# Altium schematic sheet Actuators.SchDoc: Actuators
size A3; SheetNumber: 6
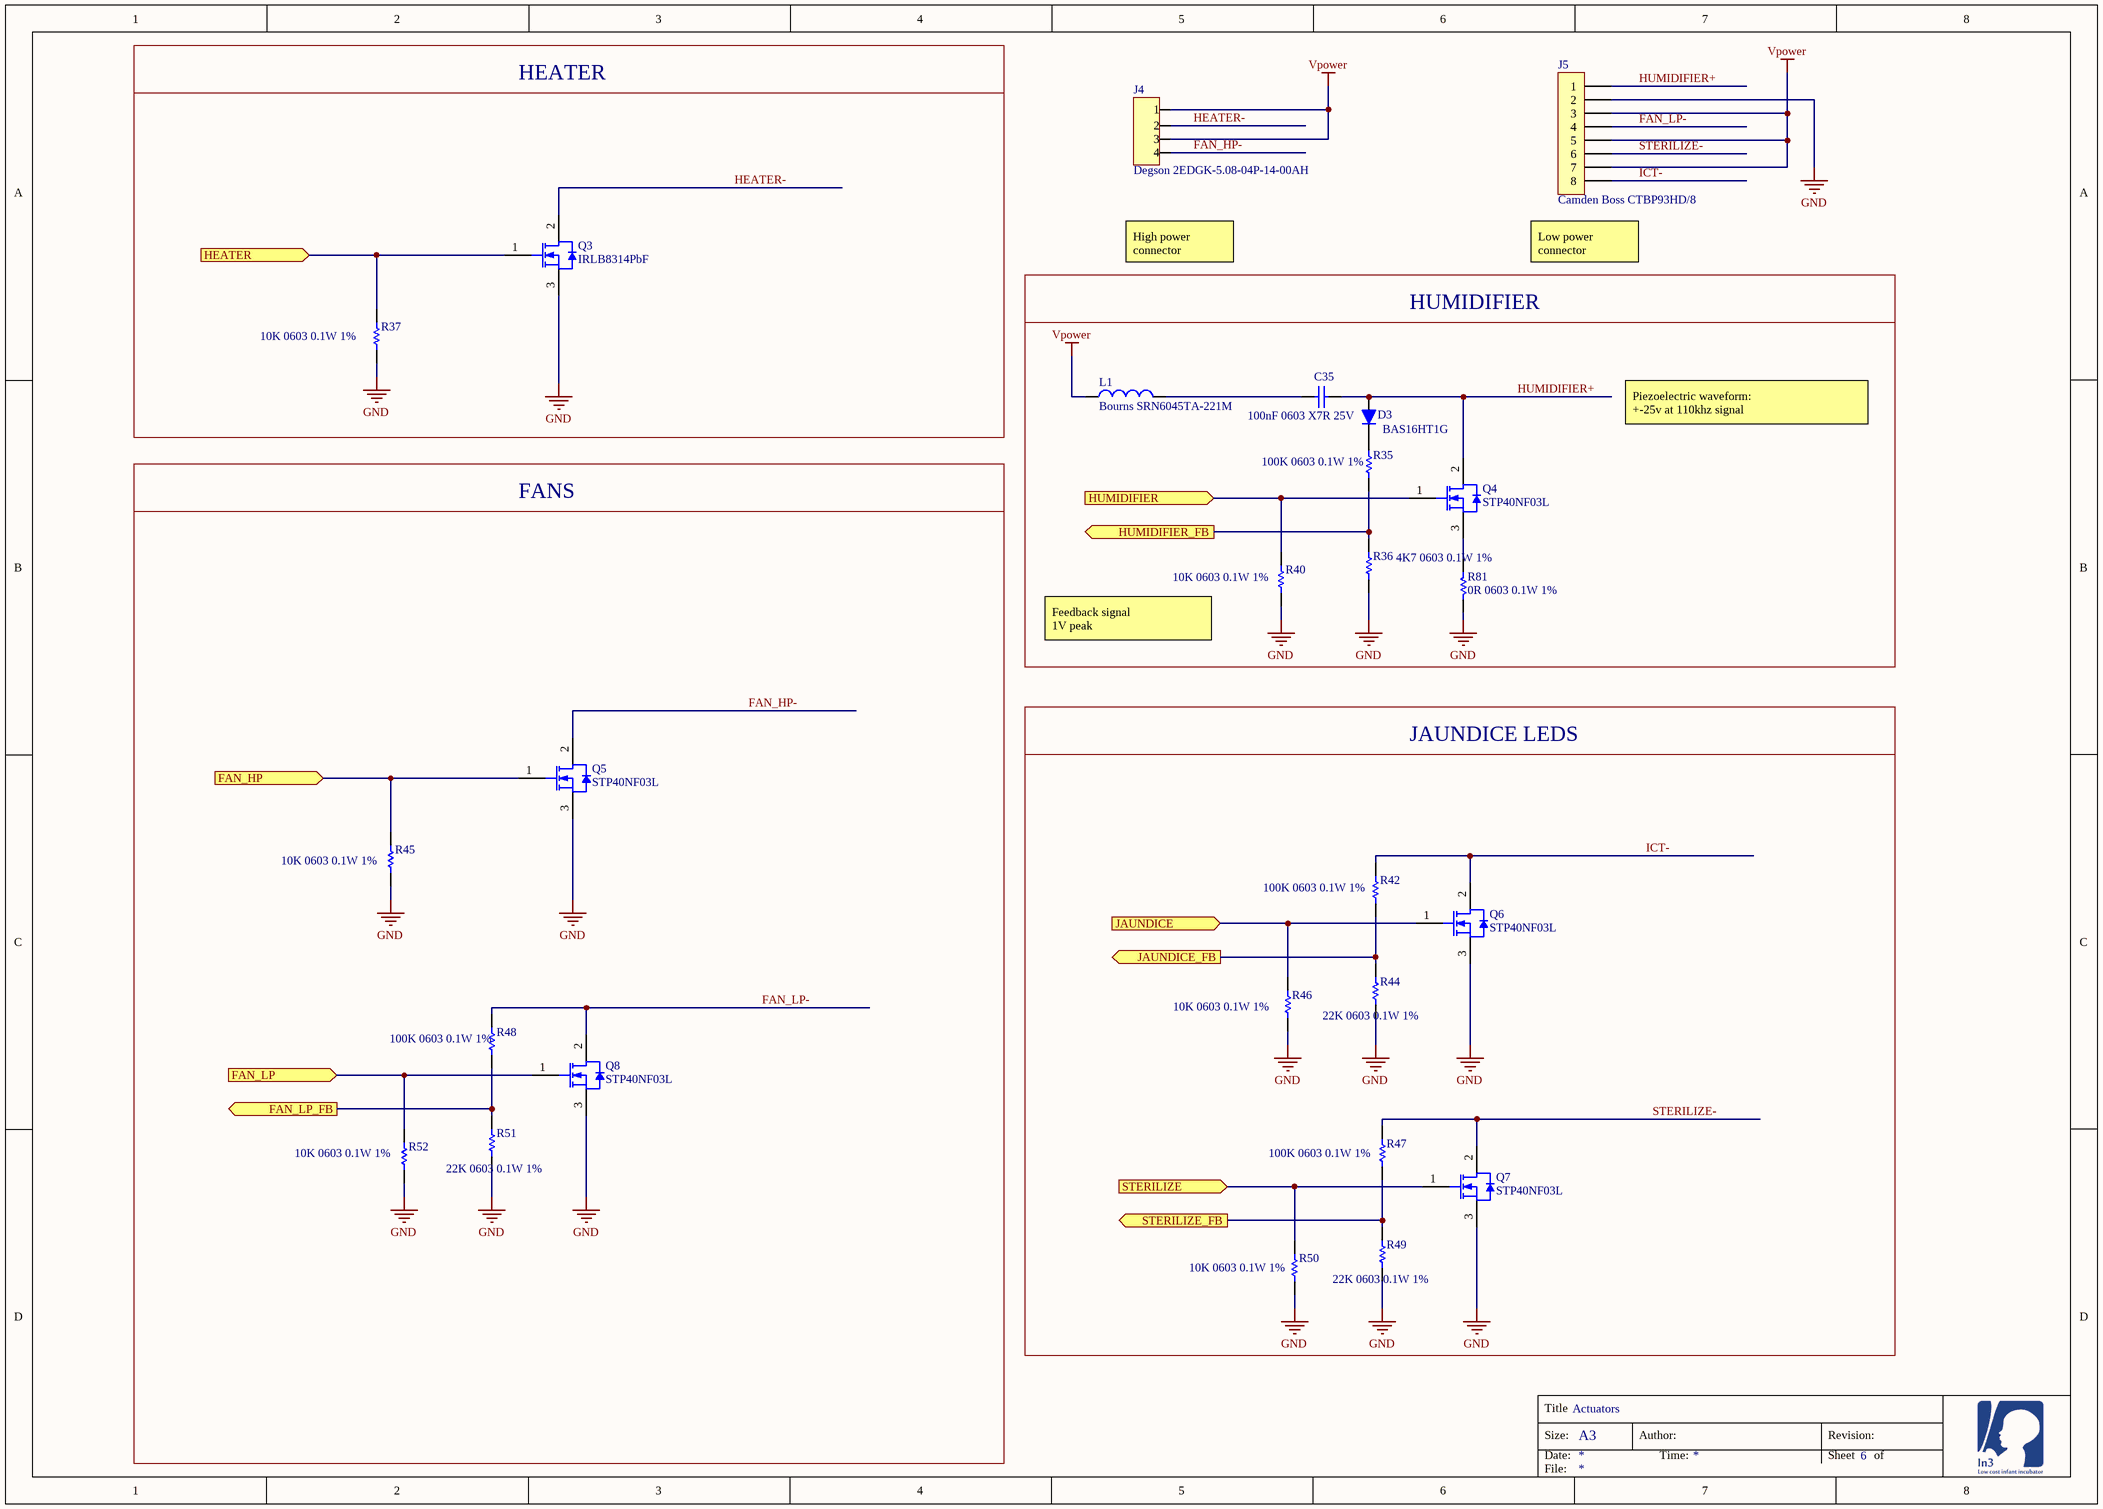
[diagram p0: Actuators.SchDoc]

## Parts
C35  100nF 0603 X7R 25V  [CAPC1608X60X35NL10T15]
D3  Manufacturer Part Number: BAS16HT1G  [PCB-eawsmpajajexc0e6wrcv-1]  (hidden comment: ON Semiconductor BAS16HT1G)
J4  Degson 2EDGK-5.08-04P-14-00AH  [PCB-h4cyb3wxd4gf7j132tzl-1]
J5  Camden Boss CTBP93HD/8  [PCB-x5bf0tdd06kg49qqqpah-1]
L1  Bourns SRN6045TA-221M  [PCB-wv16t2tzy3vtnr72ahin-1]
Q3  IRLB8314PbF  [ONSC-TO-220-3-221A-07]
Q4  STP40NF03L  [ONSC-TO-220-3-221A-07]
Q5  STP40NF03L  [ONSC-TO-220-3-221A-07]
Q6  STP40NF03L  [ONSC-TO-220-3-221A-07]
Q7  STP40NF03L  [ONSC-TO-220-3-221A-07]
Q8  STP40NF03L  [ONSC-TO-220-3-221A-07]
R35  100K 0603 0.1W 1%  [RESC1609X55X30ML10T20]
R36  4K7 0603 0.1W 1%  [RESC1609X55X30ML10T20]
R37  10K 0603 0.1W 1%  [RESC1609X55X30ML10T20]
R40  10K 0603 0.1W 1%  [RESC1609X55X30ML10T20]
R42  100K 0603 0.1W 1%  [RESC1609X55X30ML10T20]
R44  22K 0603 0.1W 1%  [RESC1609X55X30ML10T20]
R45  10K 0603 0.1W 1%  [RESC1609X55X30ML10T20]
R46  10K 0603 0.1W 1%  [RESC1609X55X30ML10T20]
R47  100K 0603 0.1W 1%  [RESC1609X55X30ML10T20]
R48  100K 0603 0.1W 1%  [RESC1609X55X30ML10T20]
R49  22K 0603 0.1W 1%  [RESC1609X55X30ML10T20]
R50  10K 0603 0.1W 1%  [RESC1609X55X30ML10T20]
R51  22K 0603 0.1W 1%  [RESC1609X55X30ML10T20]
R52  10K 0603 0.1W 1%  [RESC1609X55X30ML10T20]
R81  0R 0603 0.1W 1%  [RESC1609X55X30ML10T20]

## Blocks framed on the sheet
HEATER: Q3 R37
HUMIDIFIER: C35 D3 L1 Q4 R35 R36 R40 R81
FANS: Q5 Q8 R45 R48 R51 R52
JAUNDICE LEDS: Q6 Q7 R42 R44 R46 R47 R49 R50

## Ports
FAN_HP (in), FAN_LP (in), FAN_LP_FB (out), HEATER (in), HUMIDIFIER (in), HUMIDIFIER_FB (out), JAUNDICE (in), JAUNDICE_FB (out), STERILIZE (in), STERILIZE_FB (out)

## Nets
GND: J5.2 Q3.3(SOURCE) Q5.3(SOURCE) Q6.3(SOURCE) Q7.3(SOURCE) Q8.3(SOURCE) R36.1 R37.1 R40.1 R44.2 R45.1 R46.1 R49.2 R50.1 R51.1 R52.1 R81.2
Vpower: J4.1 J4.3 J5.3 J5.5 J5.7 L1.1
FAN_HP: Q5.1(GATE) R45.2 ; port FAN_HP
FAN_HP-: J4.4 Q5.2(DRAIN)
FAN_LP: Q8.1(GATE) R52.2 ; port FAN_LP
FAN_LP-: J5.4 Q8.2(DRAIN) R48.1
FAN_LP_FB: R48.2 R51.2 ; port FAN_LP_FB
HEATER: Q3.1(GATE) R37.2 ; port HEATER
HEATER-: J4.2 Q3.2(DRAIN)
HUMIDIFIER: Q4.1(GATE) R40.2 ; port HUMIDIFIER
HUMIDIFIER+: C35.1 D3.2(A) J5.1 Q4.2(DRAIN)
HUMIDIFIER_FB: R35.2 R36.2 ; port HUMIDIFIER_FB
ICT-: J5.8 Q6.2(DRAIN) R42.2
JAUNDICE: Q6.1(GATE) R46.2 ; port JAUNDICE
JAUNDICE_FB: R42.1 R44.1 ; port JAUNDICE_FB
STERILIZE: Q7.1(GATE) R50.2 ; port STERILIZE
STERILIZE-: J5.6 Q7.2(DRAIN) R47.2
STERILIZE_FB: R47.1 R49.1 ; port STERILIZE_FB
NetC35_2: C35.2 L1.2
NetD3_1: D3.1(K) R35.1
NetQ4_3: Q4.3(SOURCE) R81.1

## Notes on the sheet
- High power connector
- (near J5) Low power connector
- Piezoelectric waveform:
  +-25v at 110khz signal
- Feedback signal
  1V peak
- Title
- Size:
- Date:
- A3
- Author:
- Time:
- Revision:
- Sheet
- of
- File:

## Library data of the parts
C35 = CMP-c41a0d2b65641bdd-3: package: 0603; capacitance: 100 nF; Dielectric Characteristic: X7R; Rated voltage: 25V
D3 = CMP-817941-4: Diode; Rectifier; Switching; Vr 75VDC; If 200mA; Pkg SOD-323; Vf 1250mV; Trr 6ns; Cj 2pF; Polarity: Standard; Voltage Rating (DC): 75.0 V, 85.0 V; Output Current: 200 mA (max); Lead-Free Status: Lead Free; Octopart URL: https://octopart.com/bas16ht1g-on+semiconductor-44707; RoHS: Compliant; REACH SVHC Compliance: No SVHC; Number of Pins: 2
J4 = CMP-2530e97077dcfaf7-3: Terminal block, 5.08mm 4 Pos, through hole male.; Manufacturer Part Number: 2EDGA-5.08-04P-14-00AH; Octopart URL: https://octopart.com/2edga-5.08-04p-14-00ah-degson-88766346; OctopartID: 2530e97077dcfaf7
J5 = CMP-6d76a041b9e0b2b1-3: 3.5mm pluggable terminal block, header, 8P; Gender: Male; Color: Green; Octopart URL: https://octopart.com/ctbp93hd%2F8-camden+boss-71168496; OctopartID: 6d76a041b9e0b2b1; Manufacturer Part Number: CTBP93HD/8; RoHS: Compliant
L1 = CMP-d1e61c97cd460e21-1: Inductor Power Semi-Shielded Wirewound 220uH 20% 1MHz 15Q-Factor Ferrite 0.6A 0.9Ohm DCR 2424 Automotive T/R; Inductance: 220 µH; Octopart URL: https://octopart.com/srn6045ta-221m-bourns-75184582; Manufacturer Part Number: SRN6045TA-221M; Packaging: Cut Tape (CT); RoHS: Compliant; OctopartID: d1e61c97cd460e21
Q3 = CMP-lktjqnj8y0zfb5fwtotb-1: MOSFET Transistor, N Channel, 130 A, 30 V, 0.0019 ohm, 10 V, 1.7 V; Manufacturer: Infineon; Transistor type: MOSFET N-Channel; Id: 171A; Rdson: 1.9 mOhms; Manufacturer Part Number: IRLB8314PbF; CustomComponentID: lktjqnj8y0zfb5fwtotb
Q4-Q8 = CMP-lktjqnj8y0zfb5fwtotb-1: Manufacturer: Infineon; Manufacturer Part Number: IRLB8314PbF; Transistor type: MOSFET N-Channel; Id: 171A; Rdson: 1.9 mOhms; CustomComponentID: lktjqnj8y0zfb5fwtotb
R35 R44 R48 R49 = CMP-3655986-6: Resistance: 30k; Tolerance: 1%; package: 0603
R36 = CMP-3655986-6: Resistance: 4K7; Tolerance: 1%; package: 0603
R37 R40 R45 R46 R50 R52 = CMP-4716590-9: Octopart Url: https://octopart.com/crcw060310k0fkeahp-vishay-42634028; package: 0603; Resistance: 10k; Tolerance: 1%
R42 R47 = CMP-16231689-7: Manufacturer Part Number: CRCW0603100KFKEA; Lead-Free Status: Lead Free; Voltage Rating (DC): 75.0 V; Temperature Coefficient: 100.0 ppm/°C; RoHS: Compliant; Resistance: 100k; OctopartID: e5812ed694933a46; Number of Pins: 2; Resistance Tolerance: ±1%; Mounting Style: Surface Mount; Size-Length: 0.00155 m; Power Rating: 0.1 W; Size-Height: 0.00045 m; Size-Width: 0.00085 m; Octopart Url: https://octopart.com/crcw0603100kfkea-vishay-39670900; Case/Package: 0603; REACH SVHC Compliance: No SVHC
R51 = CMP-4716590-9: Resistance: 6K8; Octopart Url: https://octopart.com/crcw060310k0fkeahp-vishay-42634028; package: 0603; Tolerance: 1%
R81 = CMP-536b9a7387ce8cac-10: HelpURL: http://www.yageo.com/documents/recent/PYu-RC_Group_51_RoHS_L_9.pdf; Resistance: 0R; package: 0603; DNP: DNP